# EAGLE design fpc_icsp_adapter (EAGLE 5.11)
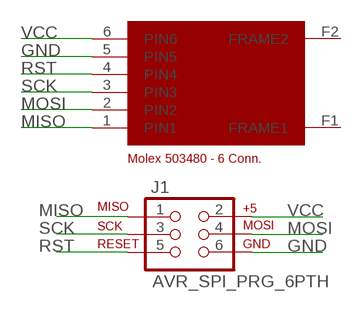
[diagram p0: schematic, sheet 1]

## Parts
J1  AVR_SPI_PRG_6PTH  [2X3]
U$1  MOLEX_503480  [MOLEX_503480]

## Nets
GND: J1.6 U$1.5(PIN5)
MISO: J1.1 U$1.1(PIN1)
MOSI: J1.4 U$1.2(PIN2)
RST: J1.5 U$1.4(PIN4)
SCK: J1.3 U$1.3(PIN3)
VCC: J1.2 U$1.6(PIN6)
Unconnected: U$1.F1(FRAME1) U$1.F2(FRAME2)

## Library data of the parts
J1 = SparkFun:AVR_SPI_PRG_6: AVR ISP 6 Pin This is the reduced ISP connector for AVR programming. Common on Arduino. This footprint will take up less PCB space and can be used with a 10-pin to 6-pin adapter such as SKU: BOB-08508
U$1 = jcole:MOLEX_503480

## Board
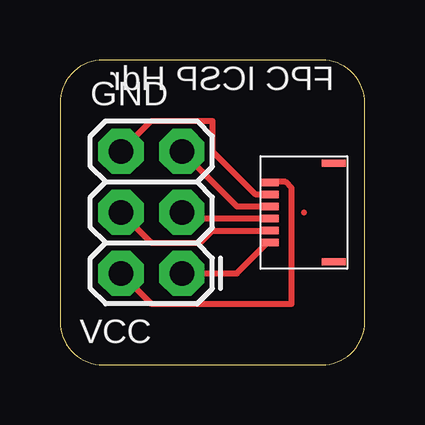
[diagram p1: board, top side]

Size 12.7 x 12.7 mm. Coordinates in mm from the lower left corner, seen from the top.
Outline: 12.7,10.9 arc90 10.9,12.7 1.8,12.7 arc90 0,10.9 0,1.8 arc90 1.8,0 10.9,0 arc90 12.7,1.8 12.7,10.9
Copper layers (1*16): Top 0.035mm / dielectric 1.5mm / Bottom 0.035mm
Design rules "default": minimum track width 10mil, minimum drill 24mil, track to track 8mil, track to pad 8mil, pad to pad 8mil, via to via 8mil, smd to smd 8mil, copper to edge 40mil, drill to drill 8mil, minimum pad ring 10mil, minimum via ring 8mil, stop-mask expansion 4mil, vias tented up to drill 0mil, thermal gap 10mil

### Footprints (pad centres in the part's own frame; a part is rotated, then mirrored left to right if it is on the bottom)
2X3 = drill 1.016 pad 1.88 octagon: 1 0,0; 2 0,2.54; 3 2.54,0; 4 2.54,2.54; 5 5.08,0; 6 5.08,2.54
MOLEX_503480 = smd 0.3 x 0.7: 1 -1.25,1.4; 2 -0.75,1.4; 3 -0.25,1.4; 4 0.25,1.4; 5 0.75,1.4; 6 1.25,1.4 | smd 0.3 x 1: F1 -2.05,-1.25; F2 2.05,-1.25

### Placement (x,y rotation side)
J1  5.08,3.81 90 top
U$1  10.16,6.35 90 top

### Tracks (layer width: path | path; a pad name or v marks a point on that pad's centre or on a via)
GND
  Top 0.254: J1.6 3.81,10.16 6.35,10.16 6.35,8.89 8.13,7.11 8.64,7.11 U$1.5
MISO
  Top 0.254: J1.1 7.37,3.81 8.64,5.08 U$1.1
MOSI
  Top 0.254: J1.4 3.81,5.08 5.84,5.08 6.35,5.59 8.64,5.59 U$1.2
RST
  Top 0.254: J1.5 7.37,6.6 8.64,6.6 U$1.4
SCK
  Top 0.254: J1.3 5.33,6.1 8.64,6.1 U$1.3
VCC
  Top 0.254: J1.2 3.81,2.54 9.65,2.54 9.65,7.37 9.4,7.62 8.89,7.62 U$1.6

### Text on the board
tNames: GND | FPC ICSP Hdr | VCC
bNames: (c) J. Cole